# Altium schematic sheet Battery charger.SchDoc
size A; SheetNumber: 4; SheetTotal: 6
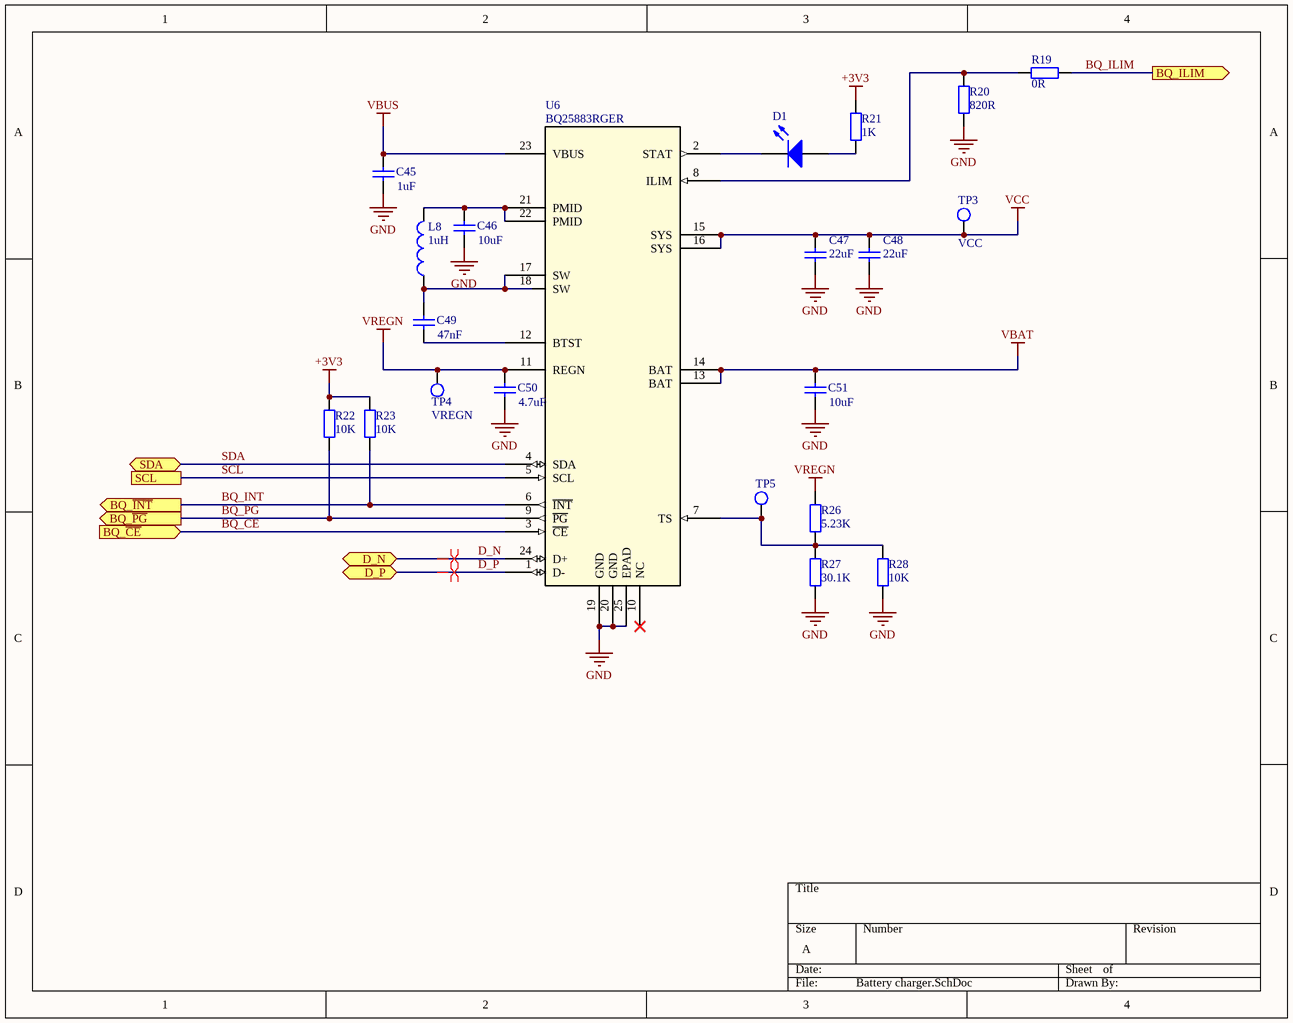
[diagram p0: Battery charger.SchDoc]

## Parts
C45  1uF  [0402]
C46  10uF  [0402]
C47  value 22uF  [0402]  (hidden comment: Cap)
C48  value 22uF  [0402]  (hidden comment: Cap)
C49  47nF  [0402]
C50  4.7uF  [0402]
C51  10uF  [0402]
D1  SML-D12P8WT86  (value not drawn)
L8  value 1uH  [0402-A]  (hidden comment: Inductor)
R19  0R  [SMD-0402-RES]
R20  820R  [SMD-0402-RES]
R21  1K  [SMD-0402-RES]
R22  10K  [SMD-0402-RES]
R23  10K  [SMD-0402-RES]
R26  5.23K  [SMD-0402-RES]
R27  30.1K  [SMD-0402-RES]
R28  10K  [SMD-0402-RES]
TP3  VCC  [testpoint 1 mm]  (no BOM)
TP4  VREGN  [testpoint 1 mm]  (no BOM)
TP5  VREGN  [testpoint 1 mm]  (value not drawn)  (no BOM)
U6  BQ25883RGER  [BQ25883RGER]

## Ports
BQ_ILIM (out, see MCU[3B]), BQ_~{CE} (in, see MCU[3B]), BQ_~{INT} (out, see MCU[1C]), BQ_~{PG} (out, see MCU[1C]), D_N (bidir, see Connectors[2B]), D_P (bidir, see Connectors[2B]), SCL (see GNSS modulis[3B], MCU[1C]), SDA (bidir, see GNSS modulis[3B], MCU[1C])

## Nets
+3V3: R21.1 R22.2 R23.2
GND: C45.1 C46.1 C47.1 C48.1 C50.1 C51.1 R20.1 R27.1 R28.1 U6.19(GND) U6.20(GND) U6.25(EPAD)
VBAT: C51.2 U6.13(BAT) U6.14(BAT)
VBUS: C45.2 U6.23(VBUS)
VCC: C47.2 C48.2 TP3.1 U6.15(SYS) U6.16(SYS)
VREGN: C50.2 R26.2 TP4.1 U6.11(REGN)
BQ_CE: U6.3(~{CE}) ; port BQ_~{CE}
BQ_ILIM: R19.2 ; port BQ_ILIM
BQ_INT: R23.1 U6.6(~{INT}) ; port BQ_~{INT}
BQ_PG: R22.1 U6.9(~{PG}) ; port BQ_~{PG}
D_N: U6.24(D+) ; port D_N
D_P: U6.1(D-) ; port D_P
SCL: U6.5(SCL) ; port SCL
SDA: U6.4(SDA) ; port SDA
NetC46_2: C46.2 L8.2 U6.21(PMID) U6.22(PMID)
NetC49_1: C49.1 U6.12(BTST)
NetC49_2: C49.2 L8.1 U6.17(SW) U6.18(SW)
NetD1_1: D1.1(A) R21.2
NetD1_2: D1.2(K) U6.2(STAT)
NetR19_1: R19.1 R20.2 U6.8(ILIM)
NetR26_1: R26.1 R27.2 R28.2 TP5.1 U6.7(TS)

Not connected (* = marked no-connect by the designer): U6 10(NC)*

## Layout directives
differential pair: D_N, D_P

## Library data of the parts
C45-C51 = Cap: Capacitor; Published: 8-Jun-2000; LatestRevisionDate: 17-Jul-2002; LatestRevisionNote: Re-released for DXP Platform.; PackageReference: RAD-0.3; Publisher: Altium Limited; PackageDescription: Radial Cap, Thru-Hole; 2 Leads; 0.3 in Pin Spacing
D1 = LED: Light-Emitting Diode; AF: 1; BV: 0; BV_MAX: 1e99; EG: 1.11; FC: 0.5; IBV: 0.001; IS: 1e-14; MJSW: 0.33; NTUN: 30; TNOM: 27; XTI: 3; SimulationGenericComponent: True; CJO: 0; CJP: 0; CTA: 0; CTP: 0; FCS: 0.5; FV_MAX: 1e99; IKF: 0; IKR: 0; ISR: 1e-14; JSW: 0; JTUN: 0; JTUNSW: 0; KEG: 1; KF: 0; LEVEL: 1; N: 1; NBV: 1; NR: 1; NS: 1; PHP: 1; RS: 0; TCV: 0; TLEV: 0; TLEVC: 0; TM1: 0; TM2: 0; TPB: 0; TPHP: 0; TRS: 0; TRS2: 0; TT: 0; TTT1: 0; TTT2: 0; VJ: 1; XTITUN: 3
L8 = Inductor: Code_IEC: 1005; Published: 8-Jun-2000; LatestRevisionDate: 29-May-2009; LatestRevisionNote: IPC-7351 Footprint Added.; PackageReference: 0402-A; Publisher: Altium Limited; PackageDescription: Chip Inductor; Code_JEITA: 0402
R19-R23 R26-R28 = Res2: Resistor; Published: 8-Jun-2000; LatestRevisionDate: 17-Jul-2002; LatestRevisionNote: Re-released for DXP Platform.; PackageReference: AXIAL-0.4; Publisher: Altium Limited; PackageDescription: Axial Device, Thru-Hole; 2 Leads; 0.4 in Pin Spacing
  R19: Value: 0R
  R20: Value: 820R
  R21: Value: 1K
  R22 R23 R28: Value: 10K
  R26: Value: 5.23K
  R27: Value: 30.1K
TP3-TP5 = testpoint
U6 = BQ25883RGER: I2C 2 cell 2A Boost battery charger for USB input in a WQFN package with Power Path 24-VQFN -40 to 85; Manufacturer_Name: Texas Instruments; Copyright: Copyright (C) 2025 Ultra Librarian. All rights reserved.; Manufacturer_Part_Number: BQ25883RGER; RefDes: RefDes; Type: Type